# Altium schematic sheet cpuledin.SchDoc
size A4
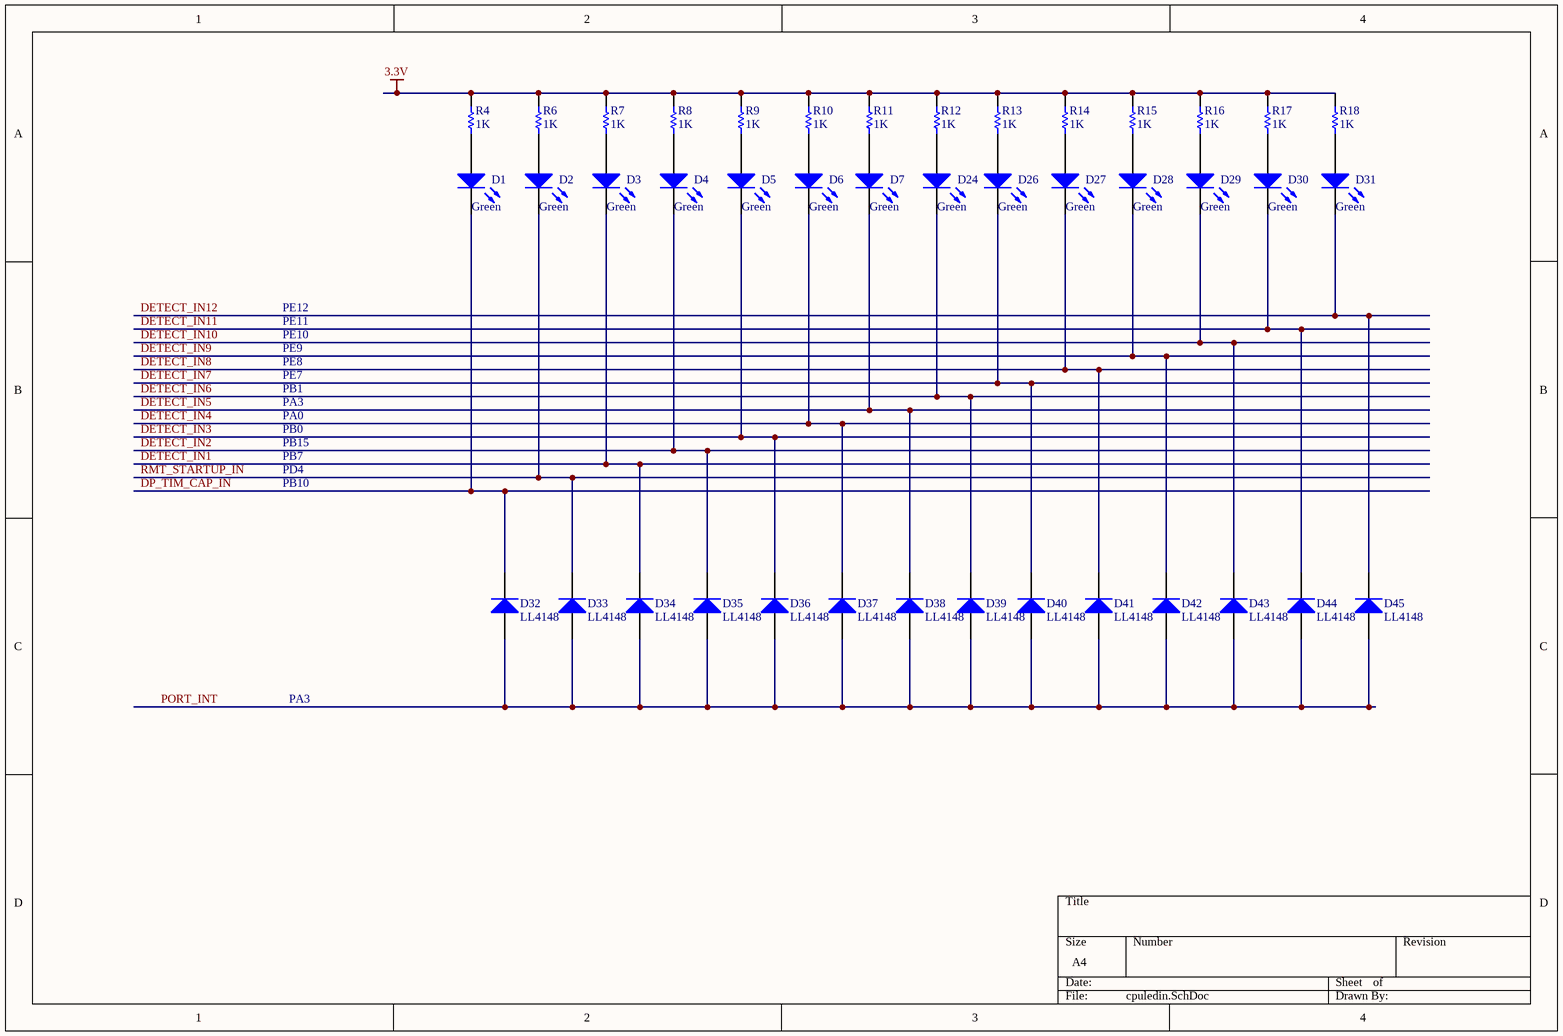
[diagram p0: cpuledin.SchDoc]

## Parts
D1  Green  [CD2012-0805]
D2  Green  [CD2012-0805]
D3  Green  [CD2012-0805]
D4  Green  [CD2012-0805]
D5  Green  [CD2012-0805]
D6  Green  [CD2012-0805]
D7  Green  [CD2012-0805]
D24  Green  [CD2012-0805]
D26  Green  [CD2012-0805]
D27  Green  [CD2012-0805]
D28  Green  [CD2012-0805]
D29  Green  [CD2012-0805]
D30  Green  [CD2012-0805]
D31  Green  [CD2012-0805]
D32  LL4148  [CD2012-0805]
D33  LL4148  [CD2012-0805]
D34  LL4148  [CD2012-0805]
D35  LL4148  [CD2012-0805]
D36  LL4148  [CD2012-0805]
D37  LL4148  [CD2012-0805]
D38  LL4148  [CD2012-0805]
D39  LL4148  [CD2012-0805]
D40  LL4148  [CD2012-0805]
D41  LL4148  [CD2012-0805]
D42  LL4148  [CD2012-0805]
D43  LL4148  [CD2012-0805]
D44  LL4148  [CD2012-0805]
D45  LL4148  [CD2012-0805]
R4  1K  [RESC2012M]
R6  1K  [RESC2012M]
R7  1K  [RESC2012M]
R8  1K  [RESC2012M]
R9  1K  [RESC2012M]
R10  1K  [RESC2012M]
R11  1K  [RESC2012M]
R12  1K  [RESC2012M]
R13  1K  [RESC2012M]
R14  1K  [RESC2012M]
R15  1K  [RESC2012M]
R16  1K  [RESC2012M]
R17  1K  [RESC2012M]
R18  1K  [RESC2012M]

## Nets
3.3V: R4.2 R6.2 R7.2 R8.2 R9.2 R10.2 R11.2 R12.2 R13.2 R14.2 R15.2 R16.2 R17.2 R18.2
DETECT_IN1: D3.2(K) D34.2(K)
DETECT_IN2: D4.2(K) D35.2(K)
DETECT_IN3: D5.2(K) D36.2(K)
DETECT_IN4: D6.2(K) D37.2(K)
DETECT_IN5: D7.2(K) D38.2(K)
DETECT_IN6: D24.2(K) D39.2(K)
DETECT_IN7: D26.2(K) D40.2(K)
DETECT_IN8: D27.2(K) D41.2(K)
DETECT_IN9: D28.2(K) D42.2(K)
DETECT_IN10: D29.2(K) D43.2(K)
DETECT_IN11: D30.2(K) D44.2(K)
DETECT_IN12: D31.2(K) D45.2(K)
DP_TIM_CAP_IN: D1.2(K) D32.2(K)
PORT_INT: D32.1(A) D33.1(A) D34.1(A) D35.1(A) D36.1(A) D37.1(A) D38.1(A) D39.1(A) D40.1(A) D41.1(A) D42.1(A) D43.1(A) D44.1(A) D45.1(A)
RMT_STARTUP_IN: D2.2(K) D33.2(K)
NetD1_1: D1.1(A) R4.1
NetD2_1: D2.1(A) R6.1
NetD3_1: D3.1(A) R7.1
NetD4_1: D4.1(A) R8.1
NetD5_1: D5.1(A) R9.1
NetD6_1: D6.1(A) R10.1
NetD7_1: D7.1(A) R11.1
NetD24_1: D24.1(A) R12.1
NetD26_1: D26.1(A) R13.1
NetD27_1: D27.1(A) R14.1
NetD28_1: D28.1(A) R15.1
NetD29_1: D29.1(A) R16.1
NetD30_1: D30.1(A) R17.1
NetD31_1: D31.1(A) R18.1

## Notes on the sheet
- PE12
- PE7
- PE8
- PE9
- PE10
- PE11
- PB15
- PB0
- PA0
- PB1
- PA3
- PB7
- PD4
- PB10

## Library data of the parts
D1-D7 D24 D26-D31 = LED1: Green LED,Output indicate.; Published: 8-Jun-2000; LatestRevisionDate: 08-Jul-2005; LatestRevisionNote: Mech Layer 1 removed.; PackageReference: LED-1; Publisher: Altium Limited
D32-D45 = Diode 1N4007: 1 Amp General Purpose Rectifier; Published: 8-Jun-2000; LatestRevisionDate: 17-Jul-2002; LatestRevisionNote: Re-released for DXP Platform.; DatasheetVersion: 1998; PackageVersion: Aug-1999; PackageReference: DO-41; Publisher: Altium Limited; Code_JEDEC: DO-204-AL; ComponentLink1Description: Manufacturer Link; ComponentLink1URL: http://www.fairchildsemi.com/; ComponentLink2Description: Datasheet; ComponentLink2URL: http://www.fairchildsemi.com/ds/1N%2F1N4001.pdf
R4 R6-R18 = Res1: Resistor; Value: 10K; Published: 8-Jun-2000; LatestRevisionDate: 17-Jul-2002; LatestRevisionNote: Re-released for DXP Platform.; PackageReference: AXIAL-0.3; Publisher: Altium Limited